# EAGLE schematic quadcopter (EAGLE 8.1.0)
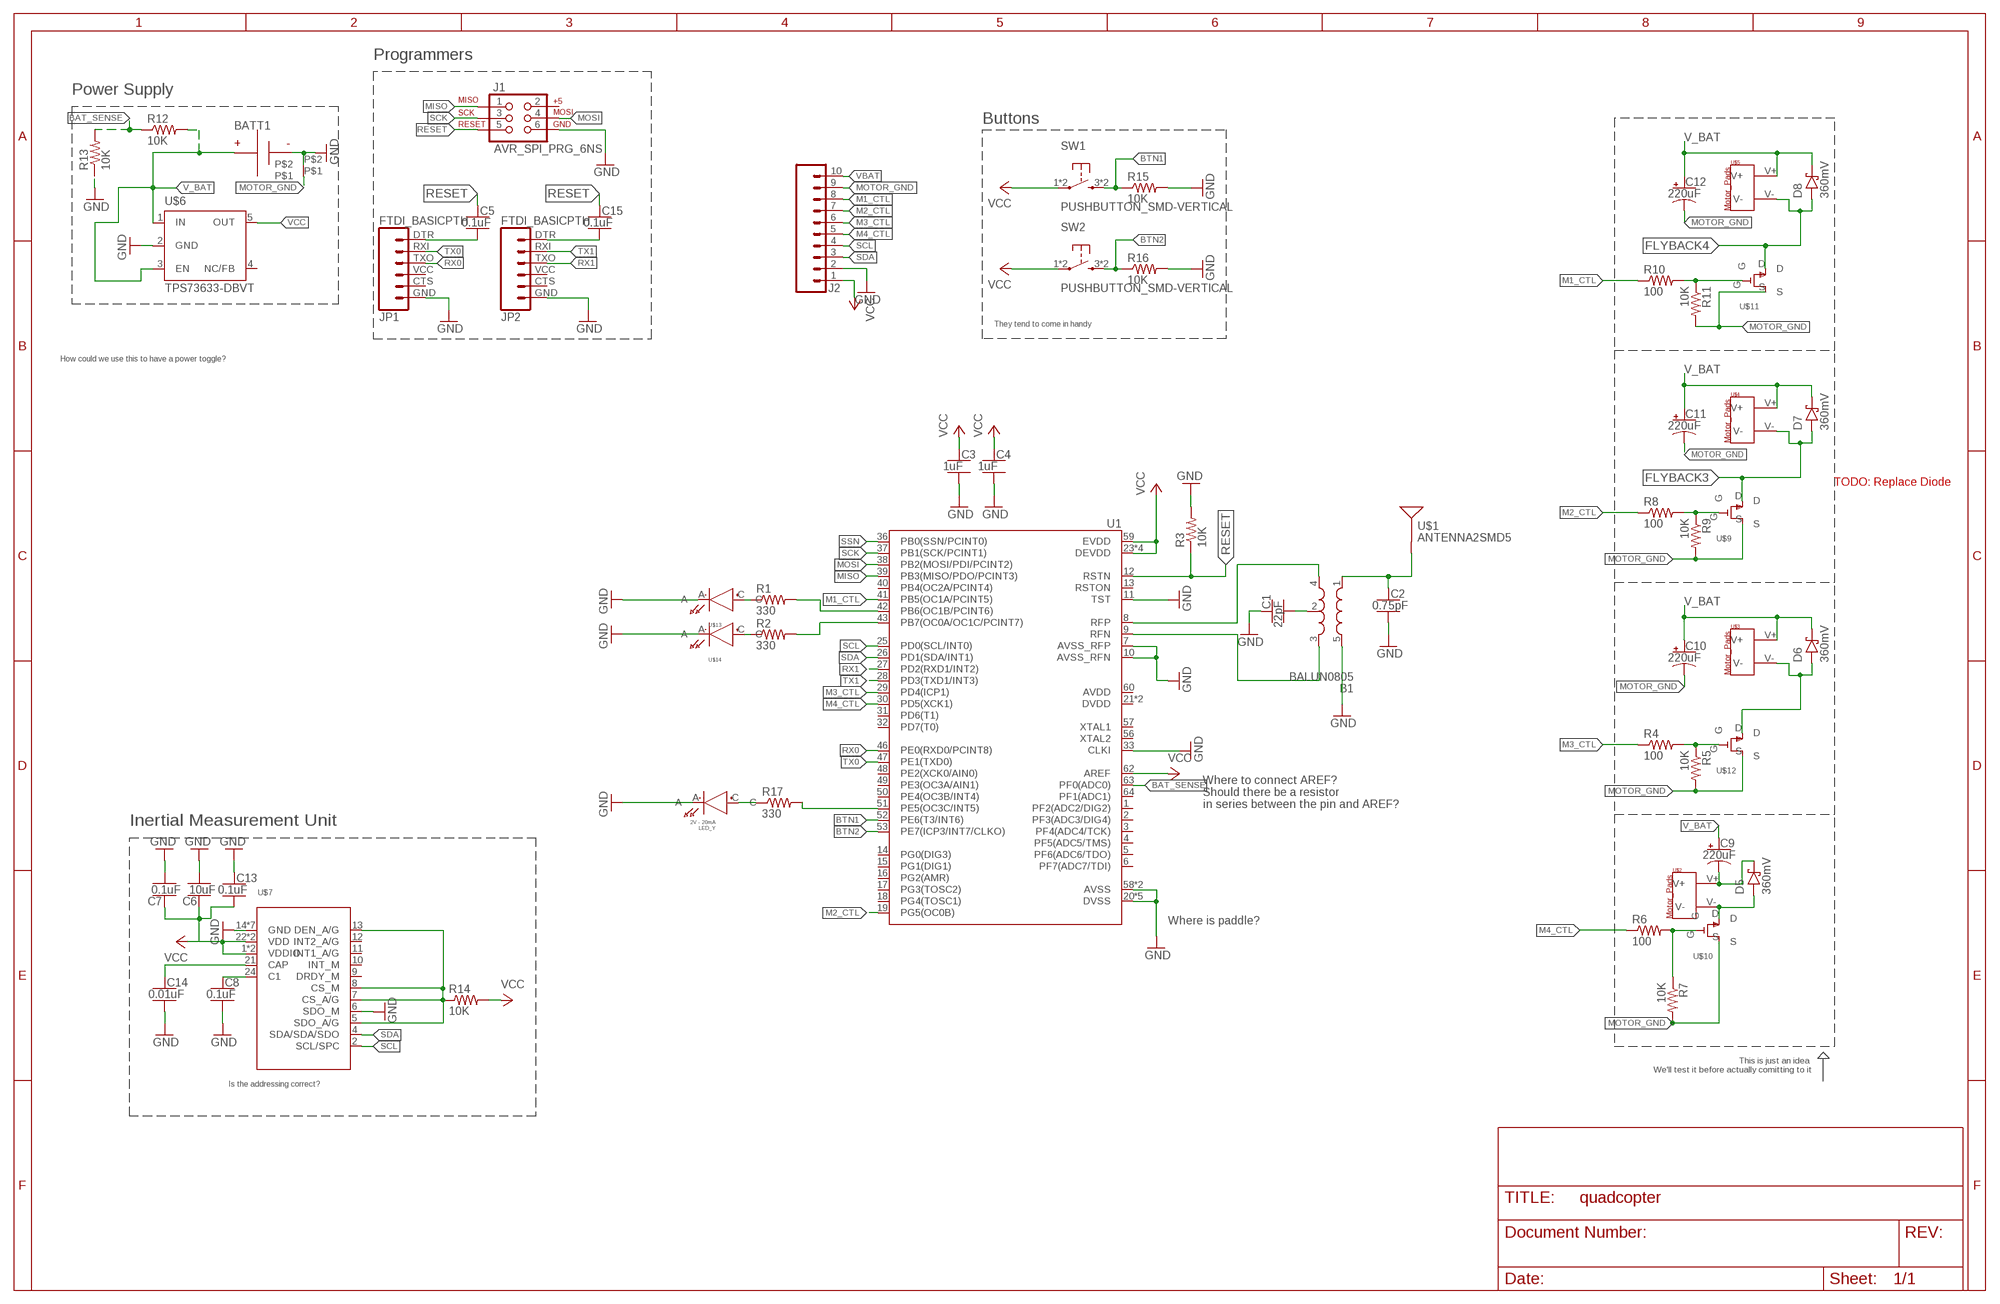
[diagram p0: schematic, sheet 1]

## Parts
B1  BALUN0805  [BALUN]
BATT1  BATTERY-HUBSAN-W/HOLDER  [BATTERY-W/HOLDER-380MAH-HUBSAN]
C1  22pF  CAPACITOR-NP_SMD-2012-0805_CERAMIC-22PF  [CAPC2012X140_HS]
C2  0.75pF  CAPACITOR-NP_SMD-2012-0805_CERAMIC-0.75PF  [CAPC2012X140_HS]
C3  1uF  CAPACITOR-NP_SMD-2012-0805_CERAMIC-1UF  [CAPC2012X140_HS]
C4  1uF  CAPACITOR-NP_SMD-2012-0805_CERAMIC-1UF  [CAPC2012X140_HS]
C5  0.1uF  CAPACITOR-NP_SMD-2012-0805_CERAMIC-0.1UF  [CAPC2012X140_HS]
C6  10uF  CAPACITOR-NP_SMD-2012-0805_CERAMIC-10UF  [CAPC2012X140_HS]
C7  0.1uF  CAPACITOR-NP_SMD-2012-0805_CERAMIC-0.1UF  [CAPC2012X140_HS]
C8  0.1uF  CAPACITOR-NP_SMD-2012-0805_CERAMIC-0.1UF  [CAPC2012X140_HS]
C9  220uF  CAPACITOR-POL_SMD-7043-D_TANTALUM-220UF  [CAPMP7343X310_HS]
C10  220uF  CAPACITOR-POL_SMD-7043-D_TANTALUM-220UF  [CAPMP7343X310_HS]
C11  220uF  CAPACITOR-POL_SMD-7043-D_TANTALUM-220UF  [CAPMP7343X310_HS]
C12  220uF  CAPACITOR-POL_SMD-7043-D_TANTALUM-220UF  [CAPMP7343X310_HS]
C13  0.1uF  CAPACITOR-NP_SMD-2012-0805_CERAMIC-0.1UF  [CAPC2012X140_HS]
C14  0.01uF  CAPACITOR-NP_SMD-2012-0805_CERAMIC-0.01UF  [CAPC2012X140_HS]
C15  0.1uF  CAPACITOR-NP_SMD-2012-0805_CERAMIC-0.1UF  [CAPC2012X140_HS]
D5  360mV  DIODE-SCHOTTKY_SMD-SOD123-360MV  [SOD3716X135_HS]
D6  360mV  DIODE-SCHOTTKY_SMD-SOD123-360MV  [SOD3716X135_HS]
D7  360mV  DIODE-SCHOTTKY_SMD-SOD123-360MV  [SOD3716X135_HS]
D8  360mV  DIODE-SCHOTTKY_SMD-SOD123-360MV  [SOD3716X135_HS]
J1  AVR_SPI_PRG_6NS  [2X3-NS]
J2  SIP-10_TH-254X10-1  [HDRV10W63P254_10X1_2540X254H838_HS]
JP1  FTDI_BASICPTH  [FTDI_BASIC]
JP2  FTDI_BASICPTH  [FTDI_BASIC]
LED_Y  2V - 20mA  LEDCMD17  [LED_LTST-C170EKT]
R1  330  RESISTOR_SMD-2012-0805-330  [RESC2012X60_HS]
R2  330  RESISTOR_SMD-2012-0805-330  [RESC2012X60_HS]
R3  10K  RESISTOR_SMD-2012-0805-10K  [RESC2012X60_HS]
R4  100  RESISTOR_SMD-2012-0805-100  [RESC2012X60_HS]
R5  10K  RESISTOR_SMD-2012-0805-10K  [RESC2012X60_HS]
R6  100  RESISTOR_SMD-2012-0805-100  [RESC2012X60_HS]
R7  10K  RESISTOR_SMD-2012-0805-10K  [RESC2012X60_HS]
R8  100  RESISTOR_SMD-2012-0805-100  [RESC2012X60_HS]
R9  10K  RESISTOR_SMD-2012-0805-10K  [RESC2012X60_HS]
R10  100  RESISTOR_SMD-2012-0805-100  [RESC2012X60_HS]
R11  10K  RESISTOR_SMD-2012-0805-10K  [RESC2012X60_HS]
R12  10K  RESISTOR_SMD-2012-0805-10K  [RESC2012X60_HS]
R13  10K  RESISTOR_SMD-2012-0805-10K  [RESC2012X60_HS]
R14  10K  RESISTOR_SMD-2012-0805-10K  [RESC2012X60_HS]
R15  10K  RESISTOR_SMD-2012-0805-10K  [RESC2012X60_HS]
R16  10K  RESISTOR_SMD-2012-0805-10K  [RESC2012X60_HS]
R17  330  RESISTOR_SMD-2012-0805-330  [RESC2012X60_HS]
SW1  PUSHBUTTON_SMD-VERTICAL  [TE_FSM8JSMA_HS]
SW2  PUSHBUTTON_SMD-VERTICAL  [TE_FSM8JSMA_HS]
U1  ATMEGA128RFA1  [QFN-64]
U$1  ANTENNA2SMD5  [ANTENNA-CHIP5]
U$2  MOTOR_PADS  [MOTOR_PADS]
U$3  MOTOR_PADS  [MOTOR_PADS]
U$4  MOTOR_PADS  [MOTOR_PADS]
U$5  MOTOR_PADS  [MOTOR_PADS]
U$6  TPS73633-DBVT  [SOT23-DBV]
U$7  IMU  [IMU_LSM9DS1TR]
U$8  NET_BRIDGE  [NET_BRIDGE]
U$9  N-FET  [N_FET_SI2302CDS-T1-E3CT-ND]
U$10  N-FET  [N_FET_SI2302CDS-T1-E3CT-ND]
U$11  N-FET  [N_FET_SI2302CDS-T1-E3CT-ND]
U$12  N-FET  [N_FET_SI2302CDS-T1-E3CT-ND]
U$13  LED-RED  [LED_LTST-C170EKT]
U$14  LED-RED  [LED_LTST-C170EKT]

## Nets
ATTENNA: B1.1(IN) C2.1 U$1.FEED(SIGNAL)
BAT_SENSE [HighAmps]: R12.1 R13.2 U1.63(PF0(ADC0))
BTN1: R15.1 SW1.3 SW1.4 U1.52(PE6(T3/INT6))
BTN2: R16.1 SW2.3 SW2.4 U1.53(PE7(ICP3/INT7/CLKO))
FLYBACK2 [HighAmps]: D6.A U$3.V- U$12.D
FLYBACK3 [HighAmps]: D7.A U$4.V- U$9.D
FLYBACK4 [HighAmps]: D8.A U$5.V- U$11.D
GND: B1.5(GND) BATT1.-(N) C1.1 C2.2 C3.2 C4.2 C6.2 C7.2 C8.2 C13.1 C14.2 J1.6 J2.2 JP1.GND JP2.GND LED_Y.A R3.2 R13.1 R15.2 R16.2 U1.7(AVSS_RFP) U1.10(AVSS_RFN) U1.11(TST) U1.20(DVSS) U1.24(DVSS) U1.33(CLKI) U1.35(DVSS) U1.45(DVSS) U1.55(DVSS) U1.58(AVSS) U1.61(AVSS) U$6.2(GND) U$7.6(SDO_M) U$7.14(GND) U$7.15(GND) U$7.16(GND) U$7.17(GND) U$7.18(GND) U$7.19(GND) U$7.20(GND) U$8.P$2 U$13.A U$14.A
M1_CTL: J2.8 R10.1 U1.41(PB5(OC1A/PCINT5))
M2_CTL: J2.7 R8.1 U1.19(PG5(OC0B))
M3_CTL [HighAmps]: J2.6 R4.1 U1.29(PD4(ICP1))
M4_CTL: J2.5 R6.1 U1.30(PD5(XCK1))
MISO: J1.1 U1.39(PB3(MISO/PDO/PCINT3))
MOSI: J1.4 U1.38(PB2(MOSI/PDI/PCINT2))
MOTOR_GND [HighAmps]: C10.2(-) C11.2(-) C12.2(-) J2.9 R5.2 R7.2 R9.2 R11.2 U$8.P$1 U$9.S U$10.S U$11.S U$12.S
N$1: C5.2 JP1.DTR
N$2: R2.2 U1.43(PB7(OC0A/OC1C/PCINT7))
N$3: B1.2(GND) C1.2
N$4: R1.2 U1.42(PB6(OC1B/PCINT6))
N$5: R1.1 U$13.C
N$6: R2.1 U$14.C
N$7: D5.A U$2.V- U$10.D
N$8: R4.2 R5.1 U$12.G
N$9: C8.1 U$7.24(C1)
N$10: R14.1 U$7.5(SDO_A/G) U$7.7(CS_A/G) U$7.8(CS_M) U$7.13(DEN_A/G)
N$11: R8.2 R9.1 U$9.G
N$12: R6.2 R7.1 U$10.G
N$13: R10.2 R11.1 U$11.G
N$14: C14.1 U$7.21(CAP)
N$15: C9.2(-) D5.C U$2.V+
N$16: C15.2 JP2.DTR
N$17: R17.2 U1.51(PE5(OC3C/INT5))
N$18: LED_Y.C R17.1
RESET: C5.1 C15.1 J1.5 R3.1 U1.12(RSTN)
RFN: B1.3(OUT2) U1.9(RFN)
RFP: B1.4(OUT1) U1.8(RFP)
RX0: JP1.TXO U1.46(PE0(RXD0/PCINT8))
RX1: JP2.TXO U1.27(PD2(RXD1/INT2))
SCK: J1.3 U1.37(PB1(SCK/PCINT1))
SCL: J2.4 U1.25(PD0(SCL/INT0)) U$7.2(SCL/SPC)
SDA: J2.3 U1.26(PD1(SDA/INT1)) U$7.4(SDA/SDA/SDO)
SSN: U1.36(PB0(SSN/PCINT0))
TX0: JP1.RXI U1.47(PE1(TXD0))
TX1: JP2.RXI U1.28(PD3(TXD1/INT3))
V_BAT [HighAmps]: BATT1.+(P) C9.1(+) C10.1(+) C11.1(+) C12.1(+) D6.C D7.C D8.C R12.2 U$3.V+ U$4.V+ U$5.V+ U$6.1(IN) U$6.3(EN)
VBAT: J2.10
VCC: C3.1 C4.1 C6.1 C7.1 C13.2 J2.1 R14.2 SW1.1 SW1.2 SW2.1 SW2.2 U1.23(DEVDD) U1.34(DEVDD) U1.44(DEVDD) U1.54(DEVDD) U1.59(EVDD) U1.62(AREF) U$6.5(OUT) U$7.1(VDDIO) U$7.3(VDDIO) U$7.22(VDD) U$7.23(VDD)
Unconnected: J1.2 JP1.CTS JP1.VCC JP2.CTS JP2.VCC U1.1(PF2(ADC2/DIG2)) U1.2(PF3(ADC3/DIG4)) U1.3(PF4(ADC4/TCK)) U1.4(PF5(ADC5/TMS)) U1.5(PF6(ADC6/TDO)) U1.6(PF7(ADC7/TDI)) U1.13(RSTON) U1.14(PG0(DIG3)) U1.15(PG1(DIG1)) U1.16(PG2(AMR)) U1.17(PG3(TOSC2)) U1.18(PG4(TOSC1)) U1.21(DVDD) U1.22(DVDD) U1.31(PD6(T1)) U1.32(PD7(T0)) U1.40(PB4(OC2A/PCINT4)) U1.48(PE2(XCK0/AIN0)) U1.49(PE3(OC3A/AIN1)) U1.50(PE4(OC3B/INT4)) U1.56(XTAL2) U1.57(XTAL1) U1.60(AVDD) U1.64(PF1(ADC1)) U$6.4(NC/FB) U$7.9(DRDY_M) U$7.10(INT_M) U$7.11(INT1_A/G) U$7.12(INT2_A/G)

## Notes on the sheet
- Programmers
- Power Supply
- Buttons
- They tend to come in handy
- How could we use this to have a power toggle?
- TODO: Replace Diode
- Where to connect AREF?
  Should there be a resistor
  in series between the pin and AREF?
- Inertial Measurement Unit
- Where is paddle?
- This is just an idea 
  We'll test it before actually comitting to it
- Is the addressing correct?

## Library data of the parts
B1 = quadparts_prebuilt:BALUN: 0805 footprint balun- Ember 351/357; DATASHEET: http://katalog.we-online.de/pbs/datasheet/748421245.pdf; DIST: Digikey; DISTPN: 732-2230-6-ND; MFR: Wurth Electronics Inc; MPN: 748421245; PRICE: 2.63
BATT1 = quadparts_prebuilt:BATTERY; CREATOR: Swanson; DIST: AMAZON; DISTPN: http://www.amazon.com/dp/B00RROB6Q4?smid=AMNTPWSAB5H0S; MFR: HUBSAN; MPN: X4-H107C-8-in-1
C1 = quadparts_prebuilt:CAPACITOR-NP_: Nonpolarized capacitor; DIST: Digikey; DISTPN: 490-5534-1-ND; MFR: Murata Electronics North America; MPN: GRM21A5C2E220JW01D
C2 = quadparts_prebuilt:CAPACITOR-NP_: Nonpolarized capacitor; DIST: Digikey; DISTPN: 490-3585-1-ND; MFR: Murata Electronics North America; MPN: GQM2195C2AR75CB01D
C3 C4 = quadparts_prebuilt:CAPACITOR-NP_: Nonpolarized capacitor; DIST: Digikey; DISTPN: 490-4736-1-ND; MFR: Murata Electronics North America; MPN: GRM21BR71H105KA12L
C5 C7 C8 C13 C15 = quadparts_prebuilt:CAPACITOR-NP_: Nonpolarized capacitor; DIST: Digikey; DISTPN: 490-1666-1-ND; MFR: Murata Electronics North America; MPN: GRM21BR71H104KA01L
C6 = quadparts_prebuilt:CAPACITOR-NP_: Nonpolarized capacitor; DIST: Digikey; DISTPN: 490-5523-1-ND; MFR: Murata Electronics North America; MPN: GRM21BR61E106KA73L
C9-C12 = quadparts_prebuilt:CAPACITOR-POL_: Polarized capacitor; DIST: Digikey; DISTPN: 478-8912-1-ND; MFR: AVX Corporation; MPN: TAJD227K006RNJ
C14 = quadparts_prebuilt:CAPACITOR-NP_: Nonpolarized capacitor; DIST: Digikey; DISTPN: 490-8295-1-ND; MFR: Murata Electronics North America; MPN: GRM2195C1H103FA01D
D5-D8 = quadparts_prebuilt:DIODE-SCHOTTKY_: Schottky diode; DIST: Digikey; DISTPN: CRS08QMCT-ND; MFR: Toshiba Semiconductor and Storage; MPN: CRS08(TE85L,Q,M)
J1 = quadparts_prebuilt:AVR_SPI_PRG_6: AVR ISP 6 Pin This is the reduced ISP connector for AVR programming. Common on Arduino. This footprint will take up less PCB space and can be used with a 10-pin to 6-pin adapter such as SKU: BOB-08508; DATASHEET: http://portal.fciconnect.com/Comergent//fci/drawing/67996.pdf; DIST: Digikey; DISTPN: 609-3234-ND; MFR: Amphenol FCI; MPN: 67997-206HLF; PRICE: 0.31
J2 = quadparts_prebuilt:SIP-10_: 10 pin single inline pin header, socket, or connector; DIST: Digikey; DISTPN: 609-3250-ND; MFR: Amphenol FCI; MPN: 68000-110HLF
JP1 JP2 = quadparts_prebuilt:FTDI_BASIC: FTDI Basic header with labels; DATASHEET: http://portal.fciconnect.com/Comergent//fci/drawing/68015.pdf; DIST: Digikey; DISTPN: 609-3327-ND; MFR: Amphenol FCI; MPN: 68016-406HLF; PRICE: 0.33
LED_Y = quadparts_michael:LED; CREATOR: Michael M. Gonzalez; DIST: DIGIKEY; DISTPN: L62507CT-ND; MFR: Visual Communications Company - VCC; MPN: CMD17-21VYD/TR8
R1 R2 R17 = quadparts_prebuilt:RESISTOR_: Resistor; DIST: Digikey; DISTPN: 311-330ARCT-ND; MFR: Yageo; MPN: RC0805JR-07330RL
R3 R5 R7 R9 R11-R16 = quadparts_prebuilt:RESISTOR_: Resistor; DIST: Digikey; DISTPN: 311-10KARCT-ND; MFR: Yageo; MPN: RC0805JR-0710KL
R4 R6 R8 R10 = quadparts_prebuilt:RESISTOR_: Resistor; DIST: Digikey; DISTPN: 311-100ARCT-ND; MFR: Yageo; MPN: RC0805JR-07100RL
SW1 SW2 = quadparts_prebuilt:PUSHBUTTON_: Pushbutton with 2 pins shorting 1 to 2 and two extra mounting pins 3 & 4
U1 = quadparts_prebuilt:ATMEGA128RFA1: ATmega128RFA1 8-bit AVR Microcontroller with Low Power 2.4GHz Transceiver for ZigBee and IEEE 802.15.4; CREATOR: Swanson; DATASHEET: http://www.atmel.com/Images/Atmel-8266-MCU_Wireless-ATmega128RFA1_Datasheet.pdf; DIST: Digikey; DISTPN: ATMEGA128RFA1-ZUR00DKR-ND; MFR: Atmel; MPN: ATMEGA128RFA1-ZUR00; PRICE: 10.21
U$1 = quadparts_prebuilt:ANTENNA2: Chip antenna Single endded antenna. Common with smaller chip antennas. CHIP4 package is the GPS Chip Antenna SKU: GPS-08418. CHIP5 package is 2.4GHz chip antenna SKU: WRL-00144.; DATASHEET: http://www.linxtechnologies.com/resources/data-guides/ant-xxx-chp-x.pdf; DIST: Digikey; DISTPN: ANT-2.45-CHPCT-ND; MFR: Linx Technologies Inc.; MPN: ANT-2.45-CHP-T; PRICE: 3.16
U$2-U$5 = quadparts_prebuilt:MOTOR_PADS; DIST: NA; DISTPN: NA; MFR: NA; MPN: NA
U$6 = quadparts_prebuilt:TPS73633-DBVT; DATASHEET: http://www.ti.com/lit/ds/symlink/lp3985.pdf; DIST: Digikey; DISTPN: LP3985IM5X-3.0/NOPBCT-ND; MFR: Texas Instruments; MPN: LP3985IM5X-3.0/NOPB; PRICE: 0.59
U$7 = quadparts_michael:IMU; CREATOR: Michael M. Gonzalez; DIST: Digikey; DISTPN: 497-14946-1-ND; MFR: STMicroelectronics; MPN: LSM9DS1TR
U$8 = quadparts_michael:NET_BRIDGE
U$9-U$12 = quadparts_michael:N-FET; CREATOR: Michael M. Gonzalez; DIST: Digikey; DISTPN: SI2302CDS-T1-E3CT-ND; MFR: Vishay Siliconix; MPN: SI2302CDS-T1-E3
U$13 U$14 = quadparts_michael:LED; CREATOR: Michael M. Gonzalez; DIST: Digikey; DISTPN: 160-1178-1-ND; MFR: Lite-On Inc; MPN: LTST-C170EKT

## Net classes
1 HighAmps: width 0.762 mm